# Altium schematic sheet mcu.SchDoc
size A3
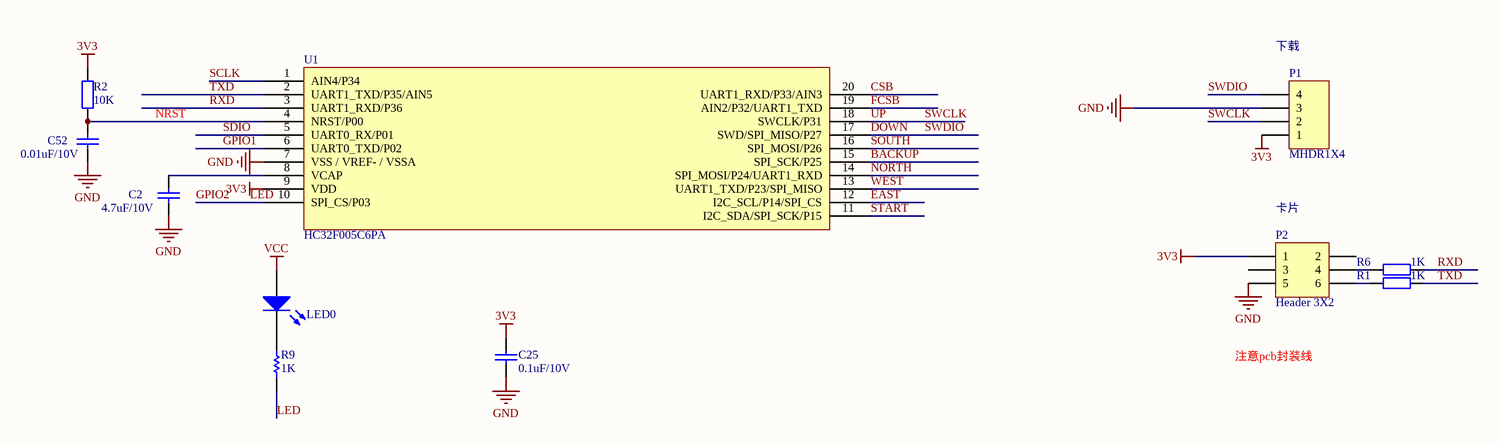
[diagram p0: mcu.SchDoc]

## Parts
?  LED0  [LED-0]
C2  4.7uF/10V  [0603C]
C25  0.1uF/10V  [0603C]
C52  0.01uF/10V  [0603C]
P1  MHDR1X4  [SIP4]
P2  Header 3X2
R1  1K  [0603R]
R2  10K  [0603R]
R6  1K  [0603R]
R9  1K  [AXIAL-0.3]
U1  HC32F005C6PA

## Nets
3V3: C25.1 P1.1 P2.1 R2.2 U1.9(VDD)
GND: C2.2 C25.2 C52.2 P1.3 P2.5 U1.7(VSS_/_VREF-_/_VSSA)
VCC: ?.1(A)
BACKUP: U1.15(SPI_SCK/P25)
CSB: U1.20(UART1_RXD/P33/AIN3)
DOWN: P1.4 U1.17(SWD/SPI_MISO/P27)  [also labelled SWDIO]
EAST: U1.12(I2C_SCL/P14/SPI_CS)
FCSB: U1.19(AIN2/P32/UART1_TXD)
GPIO1: U1.6(UART0_TXD/P02)
GPIO2: R9.1 U1.10(SPI_CS/P03)  [also labelled LED]
NORTH: U1.14(SPI_MOSI/P24/UART1_RXD)
NRST: C52.1 R2.1 U1.4(NRST/P00)
RXD: R6.1 U1.3(UART1_RXD/P36)
SCLK: U1.1(AIN4/P34)
SDIO: U1.5(UART0_RX/P01)
SOUTH: U1.16(SPI_MOSI/P26)
START: U1.11(I2C_SDA/SPI_SCK/P15)
SWCLK: P1.2 U1.18(SWCLK/P31)  [also labelled UP]
TXD: R1.1 U1.2(UART1_TXD/P35/AIN5)
WEST: U1.13(UART1_TXD/P23/SPI_MISO)
Net?_2: ?.2(K) R9.2
NetC2_1: C2.1 U1.8(VCAP)
NetP2_4: P2.4 R6.2
NetP2_6: P2.6 R1.2

Not connected (* = marked no-connect by the designer): P2 2 3

## Notes on the sheet
- (near P1) 下载
- (near P2) 卡片
- 注意pcb封装线

## Library data of the parts
? = LED0: Typical INFRARED GaAs LED; Published: 8-Jun-2000; LatestRevisionDate: 08-Jul-2005; LatestRevisionNote: Mech Layer 1 removed.; PackageReference: LED-0; Publisher: Altium Limited; PackageDescription: LED; 2 Leads
C2 C25 C52 = Cap: Capacitor; Value: 106; Published: 8-Jun-2000; LatestRevisionDate: 17-Jul-2002; LatestRevisionNote: Re-released for DXP Platform.; PackageReference: RAD-0.3; Publisher: Altium Limited
P1 = MHDR1X4: Header, 4-Pin; LatestRevisionDate: 17-Jul-2002; LatestRevisionNote: Re-released for DXP Platform.; Publisher: Altium Limited
P2 = Header 3X2: Header, 3-Pin, Dual row; LatestRevisionDate: 17-Jul-2002; LatestRevisionNote: Re-released for DXP Platform.; Publisher: Altium Limited
R1 R2 R6 = Res2: Resistor; Value: 10K/5%/1/8W; Published: 8-Jun-2000; LatestRevisionDate: 17-Jul-2002; LatestRevisionNote: Re-released for DXP Platform.; PackageReference: AXIAL-0.4; Publisher: Altium Limited
R9 = Res1: Resistor; Published: 8-Jun-2000; LatestRevisionDate: 17-Jul-2002; LatestRevisionNote: Re-released for DXP Platform.; PackageReference: AXIAL-0.3; Publisher: Altium Limited; PackageDescription: Axial Device, Thru-Hole; 2 Leads; 0.3 in Pin Spacing